# EasyEDA Pro project 2026Rc.epro

# Schematic Schematic1
Board Name: Board1; Create Date: 2025-09-02; Page Name: P1; Project Name: 2025物流车拓展板树莓派版专用; Schematic Name: Schematic1; Update Date: 2025-09-02; Company: 嘉立创EDA; Page Size: A4; Version: V1.0
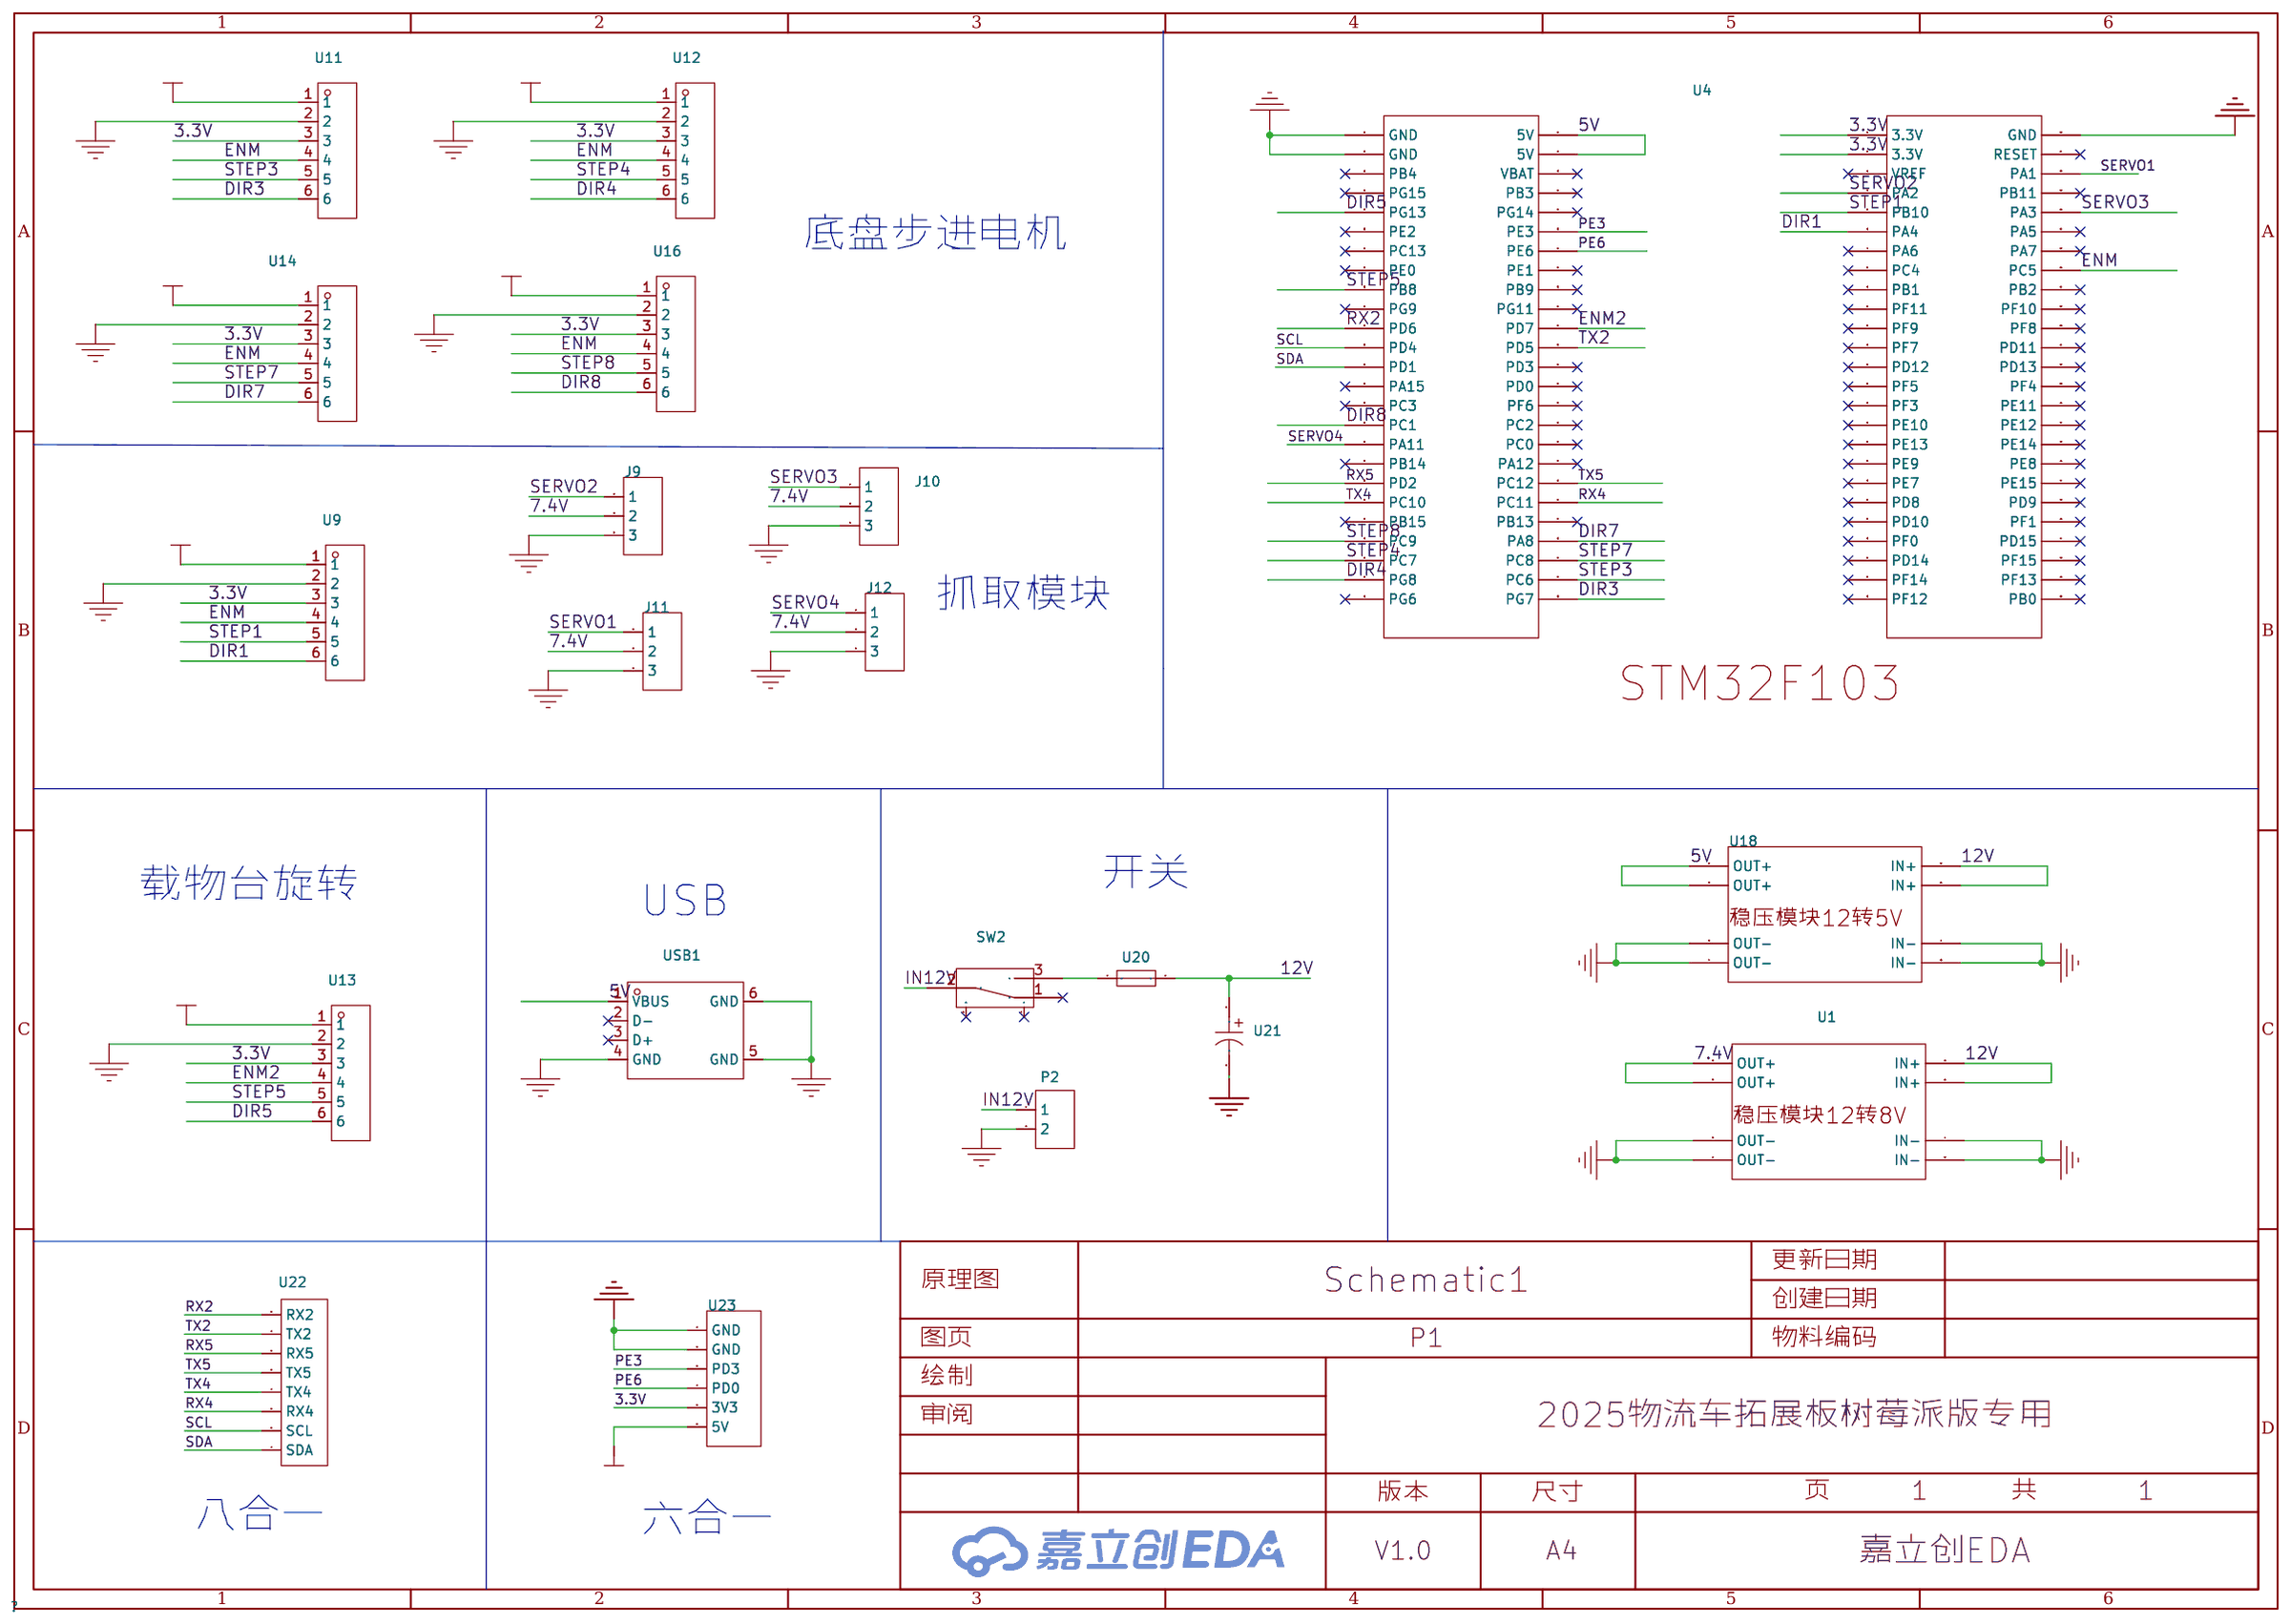
[diagram p0: schematic sheet]

## Parts
J9  舵机2  [HDR-M-2.54_1X3]
J10  舵机1  [HDR-M-2.54_1X3]
J11  舵机2  [HDR-M-2.54_1X3]
J12  舵机2  [HDR-M-2.54_1X3]
P2  输入  [CONN-TH_2P-P5.00]
SW2  SS-12F44-G5  [SW-TH_SS-12F44-G5]
U1  稳压模块12-8  [稳压模块12到8V]
U4  STM32_F103  [STM32F103]
U9  6PIN-2.54MM  [CONN-TH_XH2.54-6P]
U11  6PIN-2.54MM  [CONN-TH_XH2.54-6P]
U12  6PIN-2.54MM  [CONN-TH_XH2.54-6P]
U13  6PIN-2.54MM  [CONN-TH_XH2.54-6P]
U14  6PIN-2.54MM  [CONN-TH_XH2.54-6P]
U16  6PIN-2.54MM  [CONN-TH_XH2.54-6P]
U18  -  [稳压模块12到5V]
U20  -  [保险丝]
U21  -  [滤波电容220nf]
U22  -  [CN1]
U23  -  [CONN-TH_XH2.54-6P]
USB1  USB-231-ARY  [USB-A-TH_USB-231-ARY]

## Library data of the parts
J9 J11 J12 = 舵机2: Supplier Part: C180248; Supplier: LCSC
J10 = 舵机1: Supplier Part: C180248; Supplier: LCSC
P2 = 输入: Supplier: LCSC
SW2 = SS-12F44-G5: Supplier: LCSC; Supplier Part: C136718; Manufacturer: Rectangular Connectors - Contacts
U1 = 稳压模块12-8
U4 = STM32_F103
U9 U11-U14 U16 = 6PIN-2.54MM: Supplier: LCSC; Supplier Part: C9900021155; Manufacturer: null; JLCPCB Part Class: Extended Part
U18 = 稳压模块12-5
U20 = 保险丝
U21 = 滤波电容220nf
U22 = 八合一
U23 = 六合一
USB1 = USB-231-ARY: Supplier: LCSC; Supplier Part: C720525; Manufacturer: XUNPU(讯普); JLCPCB Part Class: Extended Part

## Nets
3.3V: U4.1(3.3V) U4.2(3.3V) U9.3 U11.3 U12.3 U13.3 U14.3 U16.3 U23.5(3V3)
5V: U4.76(5V) U4.77(5V) U18.1(OUT+) U18.2(OUT+) U23.6(5V) USB1.1(VBUS)
7.4V: J9.2 J10.2 J11.2 J12.2 U1.1(OUT+) U1.2(OUT+)
12V: U1.5(IN+) U1.6(IN+) U9.1 U11.1 U12.1 U13.1 U14.1 U16.1 U18.5(IN+) U18.6(IN+) U20.2 U21.1
GND: J9.3 J10.3 J11.3 J12.3 P2.2 U1.3(OUT-) U1.4(OUT-) U1.7(IN-) U1.8(IN-) U4.26(GND) U4.51(GND) U4.52(GND) U9.2 U11.2 U12.2 U13.2 U14.2 U16.2 U18.3(OUT-) U18.4(OUT-) U18.7(IN-) U18.8(IN-) U21.2 U23.1(GND) U23.2(GND) USB1.4(GND) USB1.5(GND) USB1.6(GND)
DIR1: U4.6(PA4) U9.6
DIR3: U4.100(PG7) U11.6
DIR4: U4.74(PG8) U12.6
DIR5: U4.55(PG13) U13.6
DIR7: U4.97(PA8) U14.6
DIR8: U4.66(PC1) U16.6
ENM: U4.33(PC5) U9.4 U11.4 U12.4 U14.4 U16.4
ENM2: U4.86(PD7) U13.4
IN12V: P2.1 SW2.2
PE3: U4.81(PE3) U23.3(PD3)
PE6: U4.82(PE6) U23.4(PD0)
RX2: U4.61(PD6) U22.8(RX2)
RX4: U4.95(PC11) U22.5(RX4)
RX5: U4.69(PD2) U22.2(RX5)
SCL: U4.62(PD4) U22.6(SCL)
SDA: U4.63(PD1) U22.7(SDA)
SERVO1: J11.1 U4.28(PA1)
SERVO2: J9.1 U4.4(PA2)
SERVO3: J10.1 U4.30(PA3)
SERVO4: J12.1 U4.67(PA11)
STEP1: U4.5(PB10) U9.5
STEP3: U4.99(PC6) U11.5
STEP4: U4.73(PC7) U12.5
STEP5: U4.59(PB8) U13.5
STEP7: U4.98(PC8) U14.5
STEP8: U4.72(PC9) U16.5
TX2: U4.87(PD5) U22.1(TX2)
TX4: U4.70(PC10) U22.4(TX4)
TX5: U4.94(PC12) U22.3(TX5)
$1N1669: SW2.3 U20.1

Not connected (* = marked no-connect by the designer): SW2 1* 4* 5*; U4 3(VREF)* 7(PA6)* 8(PC4)* 9(PB1)* 10(PF11)* 11(PF9)* 12(PF7)* 13(PD12)* 14(PF5)* 15(PF3)* 16(PE10)* 17(PE13)* 18(PE9)* 19(PE7)* 20(PD8)* 21(PD10)* 22(PF0)* 23(PD14)* 24(PF14)* 25(PF12)* 27(RESET)* 29(PB11)* 31(PA5)* 32(PA7)* 34(PB2)* 35(PF10)* 36(PF8)* 37(PD11)* 38(PD13)* 39(PF4)* 40(PE11)* 41(PE12)* 42(PE14)* 43(PE8)* 44(PE15)* 45(PD9)* 46(PF1)* 47(PD15)* 48(PF15)* 49(PF13)* 50(PB0)* 53(PB4)* 54(PG15)* 56(PE2)* 57(PC13)* 58(PE0)* 60(PG9)* 64(PA15)* 65(PC3)* 68(PB14)* 71(PB15)* 75(PG6)* 78(VBAT)* 79(PB3)* 80(PG14)* 83(PE1)* 84(PB9)* 85(PG11)* 88(PD3)* 89(PD0)* 90(PF6)* 91(PC2)* 92(PC0)* 93(PA12)* 96(PB13)*; USB1 2(D-)* 3(D+)*

## Notes on the sheet
- 底盘步进电机
- 抓取模块
- 载物台旋转
- 开关
- USB
- 八合一
- 六合一

# Board PCB1
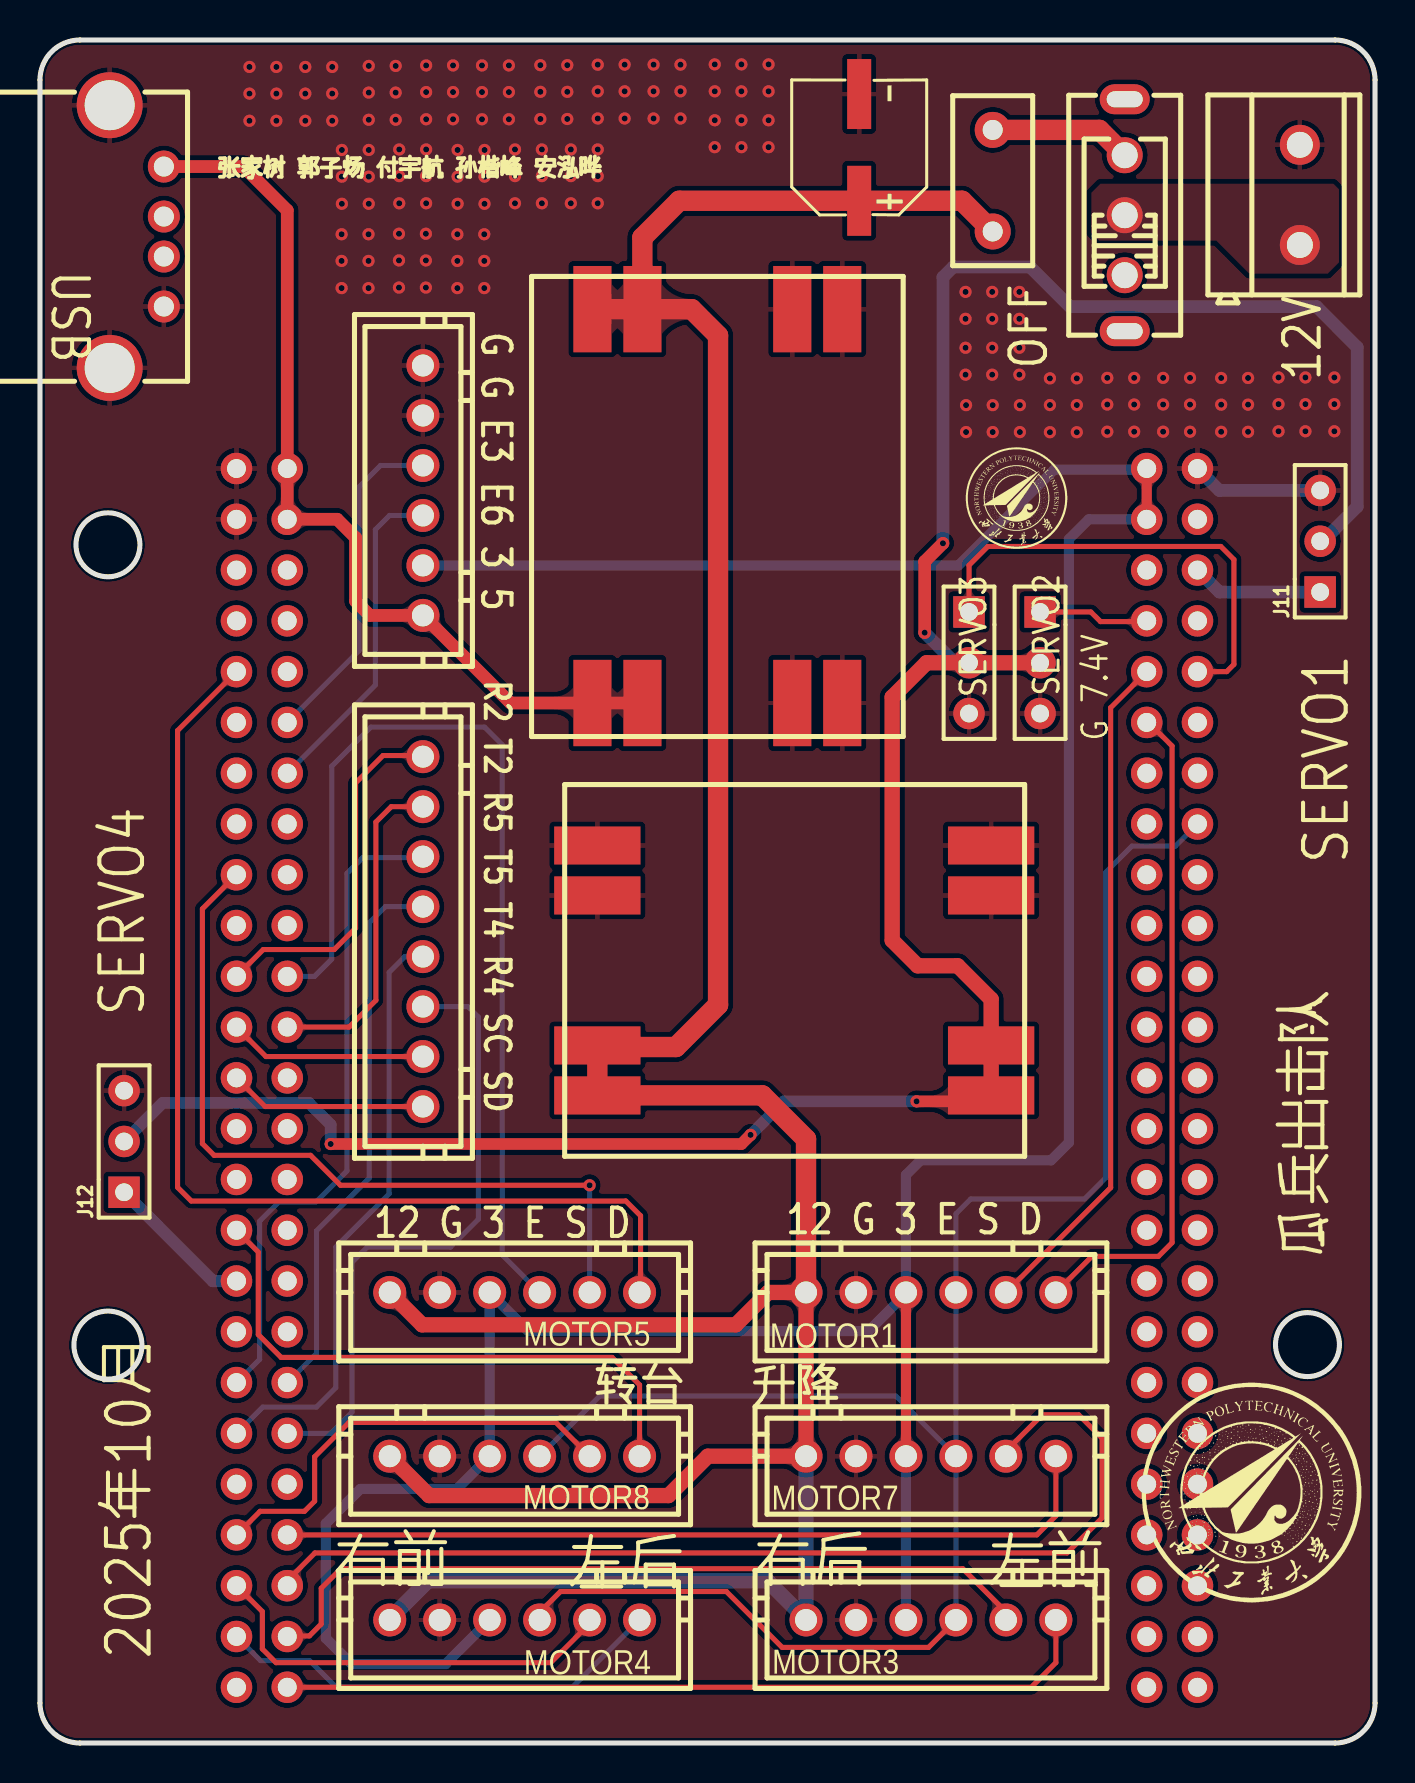
[diagram p1: board, top side]
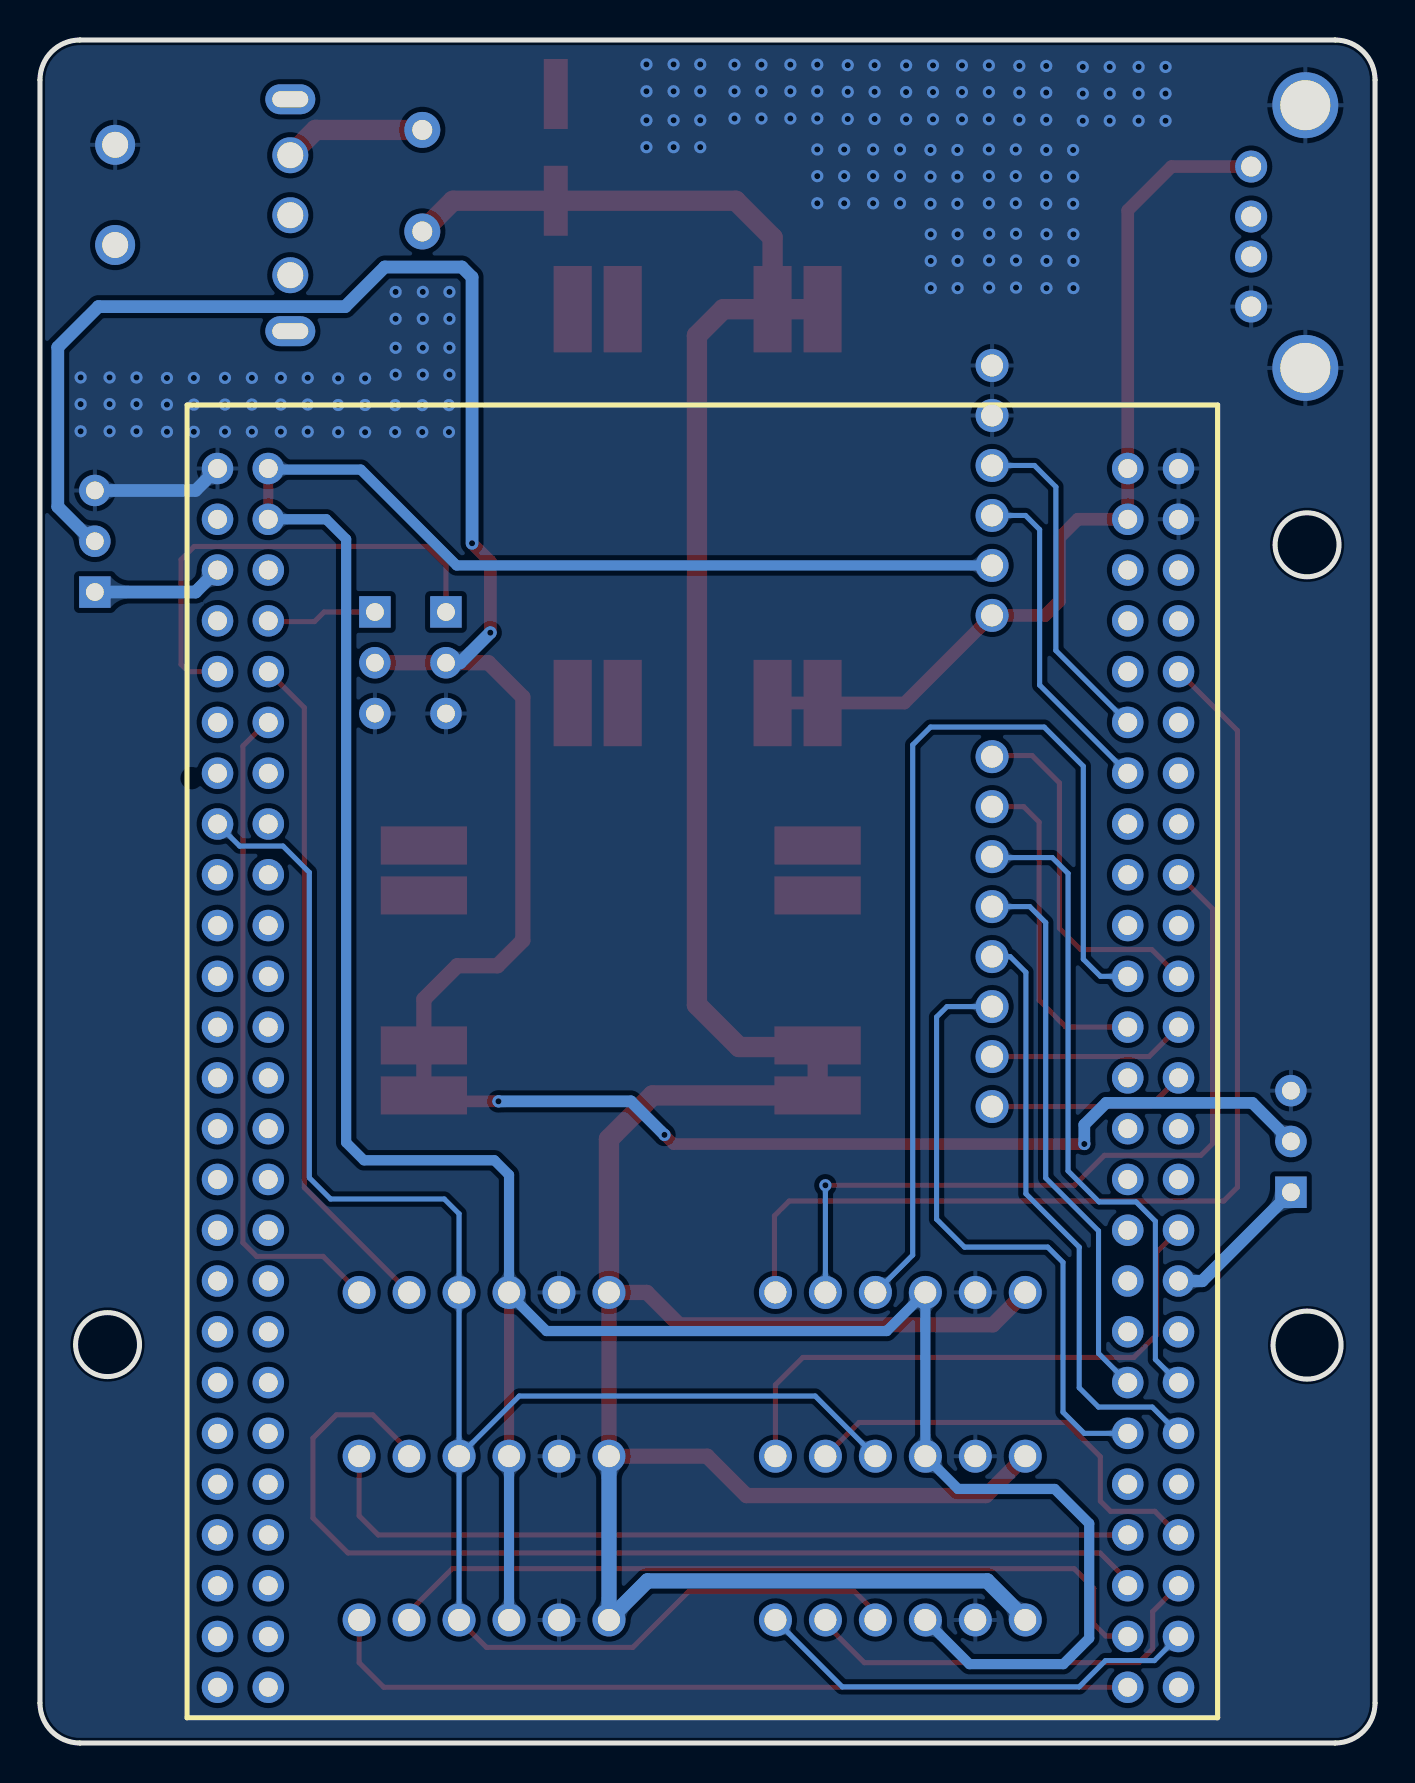
[diagram p2: board, bottom side, seen from below]

Outline 66.8 x 85.18 mm; copper layers: Top Layer, Bottom Layer. Coordinates in mm from the lower left corner of the outline.
Outline path: circle c3.4,59.93 r1.6 ; circle c3.4,19.9 r1.7 ; circle c63.42,19.93 r1.6 ; 0,83.18 0,2 arc(0.59,0.59) 2,0 64.8,0 arc(66.21,0.59) 66.8,2 66.8,83.18 arc(66.21,84.6) 64.8,85.18 2,85.18 arc(0.59,84.6) 0,83.18
Stack: Top Layer 0.035mm / Dielectric1 1.51mm FR4 er 4.5 / Bottom Layer 0.035mm

## Design rules (mm)
template: 自定义配置
spacing copperThickness1oz (default): track to track 0.102, other pairs 0.152 to 0.3
spacing copperThickness2oz: track to track 0.203, other pairs 0.152 to 0.3
track width copperThickness1oz (default): min 0.127, default 0.254, max 2.54
track width copperThickness2oz: min 0.203, default 0.254, max 2.54
track width 5V: min 0.127, default 0.762, max 2.54
track width 12V: min 0.127, default 1.016, max 2.54
track width 3.3V: min 0.127, default 0.508, max 2.54
track width GND: min 0.127, default 0.762, max 2.54
differential pair differentialPair (default): width min 0.127, default 0.254, max 2.54; gap min 0.152, default 0.152
via viaSize (default): diameter min 0.5, default 0.61, max 10; hole min 0.3, default 0.305, max 6.299

## Placement (name value [footprint] x y rotation side)
J9  舵机2  [HDR-M-2.54_1X3]  50.04 54.03 270 top
J10  舵机1  [HDR-M-2.54_1X3]  46.48 54.03 270 top
J11  舵机2  [HDR-M-2.54_1X3]  64.05 60.11 90 top
J12  舵机2  [HDR-M-2.54_1X3]  4.21 30.09 90 top
P2  输入  [CONN-TH_2P-P5.00]  63.03 77.43 90 top
SW2  SS-12F44-G5  [SW-TH_SS-12F44-G5]  54.27 76.42 90 top
U1  稳压模块12-8  [稳压模块12到8V]  37.74 38.64 0 top
U4  STM32_F103  [STM32F103]  33.66 34.09 180 bottom
U9  6PIN-2.54MM  [CONN-TH_XH2.54-6P]  44.58 22.54 0 top
U11  6PIN-2.54MM  [CONN-TH_XH2.54-6P]  44.58 6.15 0 top
U12  6PIN-2.54MM  [CONN-TH_XH2.54-6P]  23.75 6.15 0 top
U13  6PIN-2.54MM  [CONN-TH_XH2.54-6P]  23.75 22.54 0 top
U14  6PIN-2.54MM  [CONN-TH_XH2.54-6P]  44.58 14.35 0 top
U16  6PIN-2.54MM  [CONN-TH_XH2.54-6P]  23.75 14.35 0 top
U18  -  [稳压模块12到5V]  33.89 61.87 270 top
U20  -  [保险丝]  47.67 78.14 270 top
U21  -  [滤波电容220nf]  40.99 79.81 90 top
U22  -  [CN1]  19.07 40.59 270 top
U23  -  [CONN-TH_XH2.54-6P#2]  18.69 62.65 270 top
USB1  USB-231-ARY  [USB-A-TH_USB-231-ARY]  4.84 75.35 270 top

## Footprints (pads in the part's own frame, mm; a bottom-side part is the same pattern mirrored in y, then rotated)
CN1
  round 1.65 hole 1.1: 1(-6.25,0.094) 2(-3.75,0.094) 3(-1.25,0.094) 4(1.25,0.094) 5(3.75,0.094) 6(6.25,0.094) 7(8.75,0.094) 8(-8.75,0.094)
CONN-TH_2P-P5.00
  round 2 hole 1.3: 1(-2.505,0) 2(2.505,0)
CONN-TH_XH2.54-6P
  round 1.65 hole 1.1: 1(-6.25,0) 2(-3.75,0) 3(-1.25,0) 4(1.25,0) 5(3.75,0) 6(6.25,0)
CONN-TH_XH2.54-6P#2
  round 1.65 hole 1.1: 1(-6.25,0.475) 2(-3.75,0.475) 3(-1.25,0.475) 4(1.25,0.475) 5(3.75,0.475) 6(6.25,0.475)
HDR-M-2.54_1X3
  rect 1.575x1.575 hole 0.889: 1(-2.54,0)
  round 1.575 hole 0.889: 2(0,0) 3(2.54,0)
STM32F103
  round 1.575 hole 0.945: 1(-21.717,29.654) 2(-21.717,27.114) 3(-21.717,24.575) 4(-21.717,22.035) 5(-21.717,19.494) 6(-21.717,16.954) 7(-21.717,14.415) 8(-21.717,11.874) 9(-21.717,9.335) 10(-21.717,6.795) 11(-21.717,4.255) 12(-21.717,1.714) 13(-21.717,-0.826) 14(-21.717,-3.365) 15(-21.717,-5.905) 16(-21.717,-8.445) 17(-21.717,-10.986) 18(-21.717,-13.525) 19(-21.717,-16.066) 20(-21.717,-18.605) 21(-21.717,-21.145) 22(-21.717,-23.686) 23(-21.717,-26.226) 24(-21.717,-28.765) 25(-21.717,-31.305) 26(-24.257,29.654) 27(-24.257,27.114) 28(-24.257,24.575) 29(-24.257,22.035) 30(-24.257,19.494) 31(-24.257,16.954) 32(-24.257,14.415) 33(-24.257,11.874) 34(-24.257,9.335) 35(-24.257,6.795) 36(-24.257,4.255) 37(-24.257,1.714) 38(-24.257,-0.826) 39(-24.257,-3.365) 40(-24.257,-5.905) 41(-24.257,-8.445) 42(-24.257,-10.986) 43(-24.257,-13.525) 44(-24.257,-16.066) 45(-24.257,-18.605) 46(-24.257,-21.145) 47(-24.257,-23.686) 48(-24.257,-26.226) 49(-24.257,-28.765) 50(-24.257,-31.305) 51(23.823,29.654) 52(23.823,27.114) 53(23.823,24.575) 54(23.823,22.035) 55(23.823,19.494) 56(23.823,16.954) 57(23.823,14.415) 58(23.823,11.874) 59(23.823,9.335) 60(23.823,6.795) 61(23.823,4.255) 62(23.823,1.714) 63(23.823,-0.826) 64(23.823,-5.905) 65(23.823,-3.365) 66(23.823,-8.445) 67(23.823,-10.986) 68(23.823,-13.525) 69(23.823,-16.066) 70(23.823,-18.605) 71(23.823,-21.145) 72(23.823,-23.686) 73(23.823,-26.226) 74(23.823,-28.765) 75(23.823,-31.305) 76(21.283,29.654) 77(21.283,27.114) 78(21.283,24.575) 79(21.283,22.035) 80(21.283,19.494) 81(21.283,16.954) 82(21.283,14.415) 83(21.283,11.874) 84(21.283,9.335) 85(21.283,6.795) 86(21.283,4.255) 87(21.283,1.714) 88(21.283,-0.826) 89(21.283,-3.365) 90(21.283,-5.905) 91(21.283,-8.445) 92(21.283,-10.986) 93(21.283,-13.525) 94(21.283,-16.066) 95(21.283,-18.605) 96(21.283,-21.145) 97(21.283,-23.686) 98(21.283,-26.226) 99(21.283,-28.765) 100(21.283,-31.305)
SW-TH_SS-12F44-G5
  round 1.8 hole 1.3: 1(-3,0) 2(0,0) 3(3,0)
  oval 1.5x2.5 hole 0.8x1.8: 4(5.8,0) 5(-5.8,0)
USB-A-TH_USB-231-ARY
  round 1.6 hole 1: 1(-3.5,1.355) 2(-1,1.355) 3(1,1.355) 4(3.5,1.355)
  round 3.3 hole 2.5: 5(-6.57,-1.355) 6(6.57,-1.355)
保险丝
  round 1.8 hole 1: 1(-2.54,0) 2(2.54,0)
滤波电容220nf
  rect 3.5x1.2 smd: 1(-2.67,0) 2(2.67,0)
稳压模块12到5V
  rect 4.318x1.905 smd: 1(9.85,-6.252) 2(9.85,-3.752) 3(9.85,3.748) 4(9.85,6.248) 5(-9.85,-6.252) 6(-9.85,-3.752) 7(-9.85,3.748) 8(-9.85,6.248)
稳压模块12到8V
  rect 4.318x1.905 smd: 1(9.85,-6.252) 2(9.85,-3.752) 3(9.85,3.748) 4(9.85,6.248) 5(-9.85,-6.252) 6(-9.85,-3.752) 7(-9.85,3.748) 8(-9.85,6.248)

## Nets
As in the schematic.

Pads without a net: SW2 1 4 5; U4 3 7 8 9 10 11 12 13 14 15 16 17 18 19 20 21 22 23 24 25 27 29 31 32 34 35 36 37 38 39 40 41 42 43 44 45 46 47 48 49 50 53 54 56 57 58 60 64 65 68 71 75 78 79 80 83 84 85 88 89 90 91 92 93 96; USB1 2 3

## Via types
v1: diameter 0.61, hole 0.305, Top Layer to Bottom Layer, 165 vias

## Routing (per net, layer and track width the routed paths; a pad name or vN(x,y) marks a point on that pad's centre or on a via; arc(x,y) is an arc through that point)
3.3V: length 162
  Top Layer w0.508: U4.1 U4.2 ; U9.3 U14.3
  Bottom Layer w0.508: 19.16,58.9 45.95,58.9 50.74,63.69 55.32,63.69 U4.1 ; U4.2 52.47,61.21 51.48,60.21 51.48,30.04 50.59,29.15 44.06,29.15 43.33,28.42 U9.3 43.33,22.48 41.45,20.61 24.43,20.61 U13.3 U16.3 20.86,12.71 16.03,12.71 14.3,10.98 14.3,5.24 15.6,3.94 20.29,3.94 U12.3 ; U14.3 U11.3
5V: length 46
  Top Layer w0.635: USB1.1 10.18,78.85 12.37,76.66 U4.76 U4.77 14.87,61.21 15.79,60.29 15.79,57.11 16.5,56.4 U23.6 23.54,52.02 U18.1 U18.2
7.4V: length 132
  Top Layer w0.584: U1.1 47.29,32.09 v1(43.86,32.09) ; v1(35.55,30.42) 35.09,29.96 v1(14.55,29.96)
  Top Layer w0.635: v1(44.26,55.54) 44.26,59.09 v1(45.18,60.01)
  Top Layer w0.762: U1.1 U1.2 47.59,37.2 45.91,38.88 43.91,38.88 42.64,40.15 42.64,52.31 44.36,54.03 J10.2 J9.2
  Bottom Layer w0.584: v1(14.55,29.96) 14.55,30.93 13.45,32.02 6.14,32.02 J12.2 ; v1(35.55,30.42) 37.23,32.09 v1(43.86,32.09)
  Bottom Layer w0.635: J11.2 64.18,60.11 65.9,61.84 65.9,69.81 63.87,71.85 51.53,71.85 49.55,73.83 45.69,73.83 45.18,73.32 v1(45.18,60.01) ; v1(44.26,55.54) 45.77,54.03 J10.2
12V: length 174.7
  Top Layer w0.762: U16.1 19.47,12.38 31.45,12.38 33.41,14.35 U14.1 U9.1 36.43,22.54 34.81,20.92 19.12,20.92 U13.1
  Top Layer w1.016: U20.2 46.13,77.14 U21.1 31.98,77.14 30.14,75.3 U18.6 ; U9.1 38.33,30.21 36.14,32.39 U1.5 U1.6 27.97,34.81 31.82,34.81 33.93,36.92 33.93,70.4 32.6,71.72 U18.6 ; U18.6 U18.5
  Bottom Layer w0.762: 38.33,6.18 U14.1 ; 38.33,6.18 36.4,8.11 19.4,8.11 17.5,6.21 U12.1 ; 38.33,6.18 U11.1
GND: length 6.6
  Bottom Layer w0.635: U4.26 59.01,62.65 J11.3
  vias: v1(10.48,83.83) v1(10.48,82.5) v1(10.48,81.14) v1(11.83,83.83) v1(11.83,82.5) v1(11.83,81.14) v1(13.28,83.83) v1(13.28,82.5) v1(13.28,81.14) v1(14.62,83.83) v1(14.62,82.5) v1(14.62,81.14) v1(15.1,79.68) v1(15.1,78.35) v1(15.1,76.99) v1(15.09,75.47) v1(15.09,74.13) v1(15.09,72.77) v1(16.44,75.47) v1(16.44,74.13) v1(16.44,72.77) v1(16.45,83.89) v1(16.45,82.55) v1(16.45,81.19) v1(16.45,79.68) v1(16.45,78.35) v1(16.45,76.99) v1(17.8,83.89) v1(17.8,82.55) v1(17.8,81.19) v1(17.97,79.71) v1(17.97,78.37) v1(17.97,77.01) v1(17.96,75.49) v1(17.96,74.16) v1(17.96,72.8) v1(19.32,83.91) v1(19.32,82.58) v1(19.32,81.22) v1(19.32,79.71) v1(19.32,78.37) v1(19.32,77.01) v1(19.31,75.49) v1(19.31,74.16) v1(19.31,72.8) v1(20.67,83.91) v1(20.67,82.58) v1(20.67,81.22) v1(20.9,79.68) v1(20.9,78.35) v1(20.9,76.99) v1(20.88,75.47) v1(20.88,74.13) v1(20.88,72.77) v1(22.11,83.91) v1(22.11,82.58) v1(22.11,81.22) v1(22.24,79.68) v1(22.24,78.35) v1(22.24,76.99) v1(22.23,75.47) v1(22.23,74.13) v1(22.23,72.77) v1(23.46,83.91) v1(23.46,82.58) v1(23.46,81.22) v1(23.77,79.71) v1(23.77,78.37) v1(23.77,77.01) v1(25.04,83.92) v1(25.04,82.59) v1(25.04,81.23) v1(25.11,79.71) v1(25.11,78.37) v1(25.11,77.01) v1(26.38,83.92) v1(26.38,82.59) v1(26.38,81.23) v1(26.56,79.71) v1(26.56,78.37) v1(26.56,77.01) v1(27.91,83.95) v1(27.91,82.62) v1(27.91,81.26) v1(27.91,79.71) v1(27.91,78.37) v1(27.91,77.01) v1(29.25,83.95) v1(29.25,82.62) v1(29.25,81.26) v1(30.7,83.95) v1(30.7,82.62) v1(30.7,81.26) v1(32.05,83.95) v1(32.05,82.62) v1(32.05,81.26) v1(33.76,83.96) v1(33.76,82.62) v1(33.76,81.17) v1(33.76,79.82) v1(35.09,83.96) v1(35.09,82.62) v1(35.09,81.17) v1(35.09,79.82) v1(36.45,83.96) v1(36.45,82.62) v1(36.45,81.17) v1(36.45,79.82) v1(46.31,72.58) v1(46.31,71.24) v1(46.31,69.79) v1(46.31,68.44) v1(46.33,66.92) v1(46.33,65.57) v1(47.64,72.58) v1(47.64,71.24) v1(47.64,69.79) v1(47.64,68.44) v1(47.67,66.92) v1(47.67,65.57) v1(49,72.58) v1(49,71.24) v1(49,69.79) v1(49,68.44) v1(49.03,66.92) v1(49.03,65.57) v1(50.53,68.26) v1(50.53,66.92) v1(50.53,65.56) v1(51.88,68.26) v1(51.88,66.92) v1(51.88,65.56) v1(53.4,68.28) v1(53.4,66.95) v1(53.4,65.59) v1(54.75,68.28) v1(54.75,66.95) v1(54.75,65.59) v1(56.19,68.28) v1(56.19,66.95) v1(56.19,65.59) v1(57.54,68.28) v1(57.54,66.95) v1(57.54,65.59) v1(59.1,68.28) v1(59.1,66.94) v1(59.1,65.58) v1(60.44,68.28) v1(60.44,66.94) v1(60.44,65.58) v1(61.97,68.3) v1(61.97,66.97) v1(61.97,65.61) v1(63.31,68.3) v1(63.31,66.97) v1(63.31,65.61) v1(64.76,68.3) v1(64.76,66.97) v1(64.76,65.61)
DIR1: length 33.4
  Top Layer w0.254: U9.6 52.63,24.34 55.96,24.34 56.64,25.03 56.64,49.87 55.46,51.05 U4.6
DIR3: length 41.1
  Top Layer w0.254: U11.6 50.83,4.02 49.59,2.79 U4.100
DIR4: length 22.6
  Bottom Layer w0.254: U12.6 26.65,2.81 14.8,2.81 13.49,4.12 11.04,4.12 9.83,5.33
DIR5: length 54.6
  Top Layer w0.254: 9.83,53.59 6.88,50.64 6.88,27.8 7.57,27.11 29.31,27.11 30.05,26.37 30.05,22.59 U13.6
DIR7: length 41.8
  Top Layer w0.254: U14.6 50.83,11.36 49.87,10.41 U4.97
DIR8: length 29.4
  Top Layer w0.254: U16.6 30,17.91 28.63,19.29 12.07,19.29 10.92,20.43 10.92,24.56 9.83,25.65
ENM: length 96.1
  Top Layer w0.254: U11.4 44.46,4.78 37.14,4.78 34.34,7.58 26.04,7.58 25,6.54 U12.4
  Bottom Layer w0.254: U14.4 U11.4 ; U14.4 U9.4 45.83,26.47 46.57,27.21 52.26,27.21 53.32,28.27 53.32,43.54 54.64,44.86 56.81,44.86 U4.33 ; U14.4 42.82,17.36 28.01,17.36 U16.4
ENM2: length 50.1
  Bottom Layer w0.254: U4.86 13.74,38.35 14.6,39.21 14.6,48.86 16.55,50.81 22.24,50.81 23.13,49.93 23.13,24.41 U13.4
PE3: length 16.9
  Bottom Layer w0.254: 19.16,63.9 17.04,63.9 15.97,62.83 15.97,54.64 U4.81
PE6: length 16.7
  Bottom Layer w0.254: U23.4 17.49,61.4 16.78,60.7 16.78,52.92 U4.82
RX2: length 18.2
  Top Layer w0.254: U22.8 19.1,49.39 17.16,49.39 15.79,48.02 15.79,40.76 14.72,39.69 11.17,39.69 9.83,38.35
RX4: length 31.5
  Bottom Layer w0.254: U22.5 21.41,36.84 21.94,36.31 21.94,26.2 20.54,24.8 16.37,24.8 15.61,24.04 15.61,16.55 14.55,15.49 U4.95
RX5: length 33
  Bottom Layer w0.254: U22.2 19.11,44.29 16.15,44.29 15.36,43.5 15.36,28.61 13.81,27.07 11.95,27.07 10.99,26.1 10.99,19.19 9.83,18.03
SCL: length 9.9
  Top Layer w0.254: U22.6 11.31,34.34 9.83,35.81
SDA: length 9.9
  Top Layer w0.254: 9.83,33.27 11.27,31.84 U22.7
SERVO1: length 6.6
  Bottom Layer w0.635: U4.28 59.01,57.57 J11.1
SERVO2: length 5.5
  Top Layer w0.254: J9.1 52.58,56.57 53.06,56.09 55.33,56.09 U4.4
SERVO3: length 23.5
  Top Layer w0.254: J10.1 46.48,58.91 47.42,59.85 59.08,59.85 59.74,59.19 59.74,53.95 59.37,53.59 U4.30
SERVO4: length 7.5
  Bottom Layer w0.61: J12.1 8.65,23.11 9.83,23.11
STEP1: length 34
  Top Layer w0.254: U4.5 53.57,51.79 53.57,27.78 U9.5
STEP3: length 39.7
  Top Layer w0.254: U4.99 12.4,5.36 13.48,5.36 14.07,5.95 14.07,7.74 15.05,8.72 46.17,8.72 48.33,6.56 U11.5
STEP4: length 21.4
  Top Layer w0.254: 9.83,7.87 11.13,6.58 11.13,4.7 11.81,4.02 25.55,4.02 27.5,5.97 U12.5
STEP5: length 39.7
  Top Layer w0.254: 9.83,43.43 8.13,41.72 8.13,29.98 8.71,29.4 13.54,29.4 15.04,27.9 v1(27.5,27.9)
  Bottom Layer w0.254: U13.5 v1(27.5,27.9)
STEP7: length 52.6
  Top Layer w0.254: U14.5 48.33,14.6 50.14,16.42 51.97,16.42 53.14,15.25 53.14,11.26 51.39,9.51 13.76,9.51 12.37,8.12 U4.98
STEP8: length 22
  Top Layer w0.254: 9.83,10.41 11.01,11.59 13.23,11.59 13.74,12.1 13.74,14.32 15.46,16.03 25.81,16.03 U16.5
TX2: length 16.6
  Top Layer w0.254: U4.87 15.47,35.81 16.81,37.15 16.81,46.06 17.58,46.84 U22.1
TX4: length 29.8
  Bottom Layer w0.254: 9.83,15.49 11.15,16.8 13.83,16.8 14.8,17.77 14.8,24.8 17.47,27.47 17.47,38.55 18.26,39.34 U22.4
TX5: length 27.7
  Bottom Layer w0.254: U4.94 13.83,19.49 13.83,25.62 16.48,28.26 16.48,41.04 17.28,41.84 U22.3
$1N1669: length 7.1
  Top Layer w1.016: SW2.3 53,80.68 U20.1

## Copper pours and planes (outline as drawn; the poured copper is in the pictures)
GND on Top Layer: -29.75,96.76 161.33,96.76 161.33,-42.86 -29.75,-42.86
GND on Top Layer: -12.33,89.93 80.56,89.93 80.56,-3.26 -12.33,-3.26
GND on Top Layer: -13.85,90.24 118.51,90.24 118.51,-1.43 -13.85,-1.43
GND on Top Layer: -19.77,94.63 96.31,94.63 96.31,0.19 -19.77,0.19
GND on Bottom Layer: -68.23,114.97 188.28,114.97 188.28,-64.22 -68.23,-64.22
IN12V on Top Layer: 52.6,77.99 64.99,77.99 64.99,73.5 52.6,73.5

Small or netless copper shapes (teardrops, artwork), in the pictures only: 65 on Top Layer, 54 on Bottom Layer

## Text on the board
Top Silkscreen Layer: G 7.4V | SERVO3 | SERVO2 | R2 T2 R5 T5 T4 R4 SC SD | 12 G 3 E S D | G G E3 E6 3 5 | OFF | USB | 12V | SERVO4 | SERVO1 | MOTOR8 | MOTOR4 | MOTOR7 | MOTOR3 | MOTOR1 | MOTOR5 | 转台 | 升降 | 2025年10月 | 瓜兵出击队 | 右前 | 左后 | 右后 | 左前 | 张家树 郭子炀 付宇航 孙楷峰 安泓晔
